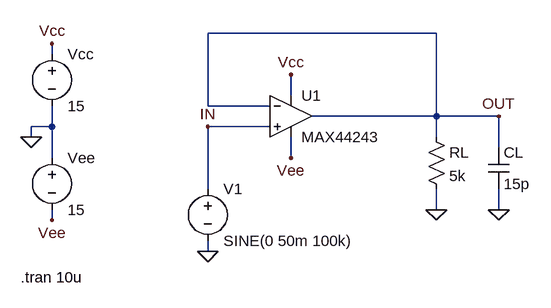
[diagram p0: schematic MAX44243.asc]
MAX44243.asc, the LTspice schematic file:
Version 4
SHEET 1 1720 800
WIRE 656 256 304 256
WIRE 64 288 64 272
WIRE 432 352 432 320
WIRE 304 368 304 256
WIRE 400 368 304 368
WIRE 656 384 656 256
WIRE 656 384 464 384
WIRE 752 384 656 384
WIRE 64 400 64 368
WIRE 64 400 32 400
WIRE 400 400 304 400
WIRE 32 416 32 400
WIRE 656 416 656 384
WIRE 752 432 752 384
WIRE 64 448 64 400
WIRE 432 448 432 416
WIRE 304 496 304 400
WIRE 656 528 656 496
WIRE 752 528 752 496
WIRE 64 544 64 528
WIRE 304 592 304 576
FLAG 752 384 OUT
FLAG 64 272 Vcc
FLAG 64 544 Vee
FLAG 432 320 Vcc
FLAG 432 448 Vee
FLAG 32 416 0
FLAG 304 592 0
FLAG 656 528 0
FLAG 304 400 IN
FLAG 752 528 0
SYMBOL voltage 64 432 R0
WINDOW 123 0 0 Left 2
SYMATTR InstName Vee
SYMATTR Value 15
SYMBOL voltage 64 272 R0
WINDOW 123 0 0 Left 2
SYMATTR InstName Vcc
SYMATTR Value 15
SYMBOL res 640 400 R0
SYMATTR InstName RL
SYMATTR Value 5k
SYMBOL voltage 304 480 R0
WINDOW 123 0 0 Left 0
WINDOW 39 0 0 Left 0
SYMATTR InstName V1
SYMATTR Value SINE(0 50m 100k)
SYMBOL cap 736 432 R0
SYMATTR InstName CL
SYMATTR Value 15p
SYMBOL MAX44243 432 320 R0
SYMATTR InstName U1
TEXT 16 632 Left 2 !.tran 10u

The netlist it stands for:
* MAX44243.asc
Vee 0 Vee 15
Vcc Vcc 0 15
RL OUT 0 5k
V1 IN 0 SINE(0 50m 100k)
CL OUT 0 15p
* U1: MAX44243 (symbol MAX44243 not available, pins judged from their places): In+=IN In-=OUT V+=Vcc V-=Vee OUT=OUT
.tran 10u
.backanno
.end